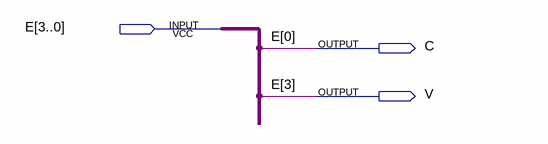
[diagram p0: schematic sheet]
// Quartus schematic Flags2.bdf as structural Verilog: 0 symbols, 3 pins
module Flags2 (
  input  [3:0] E,
  output C,
  output V
);


  assign C = E[0];
  assign V = E[3];
endmodule
